# EAGLE design EIB A79024-001 (EAGLE 9.3.2)
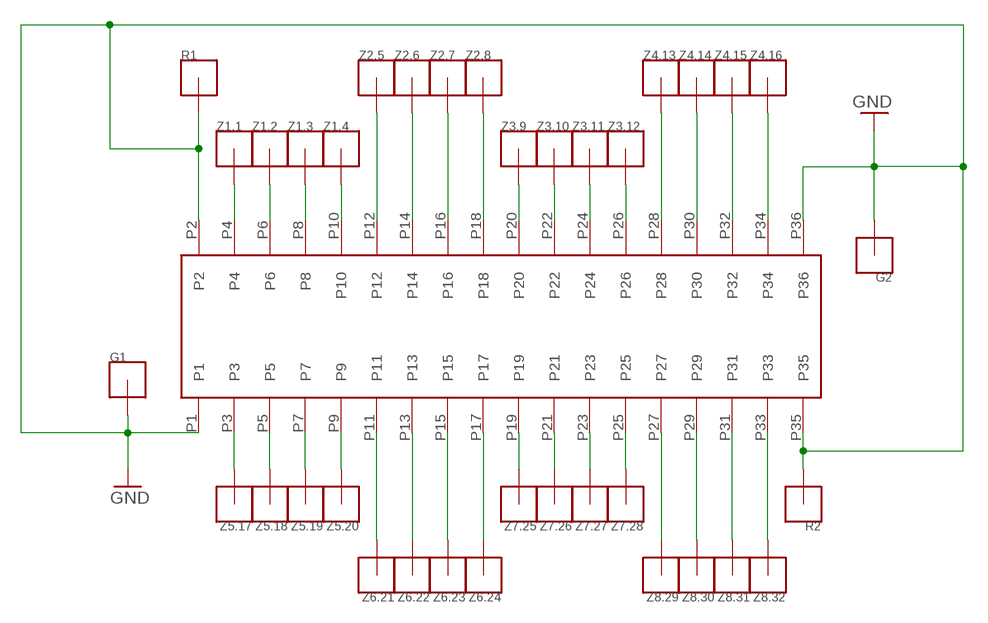
[diagram p0: schematic, sheet 1]

## Parts
A79024  OMNETICS  [A79024]
G1  S_P_HOLE  [S_P_HOLE]
G2  S_P_HOLE  [S_P_HOLE]
R1  S_P_HOLE  [S_P_HOLE]
R2  S_P_HOLE  [S_P_HOLE]
Z1.1  S_P_HOLE  [S_P_HOLE]
Z1.2  S_P_HOLE  [S_P_HOLE]
Z1.3  S_P_HOLE  [S_P_HOLE]
Z1.4  S_P_HOLE  [S_P_HOLE]
Z2.5  S_P_HOLE  [S_P_HOLE]
Z2.6  S_P_HOLE  [S_P_HOLE]
Z2.7  S_P_HOLE  [S_P_HOLE]
Z2.8  S_P_HOLE  [S_P_HOLE]
Z3.9  S_P_HOLE  [S_P_HOLE]
Z3.10  S_P_HOLE  [S_P_HOLE]
Z3.11  S_P_HOLE  [S_P_HOLE]
Z3.12  S_P_HOLE  [S_P_HOLE]
Z4.13  S_P_HOLE  [S_P_HOLE]
Z4.14  S_P_HOLE  [S_P_HOLE]
Z4.15  S_P_HOLE  [S_P_HOLE]
Z4.16  S_P_HOLE  [S_P_HOLE]
Z5.17  S_P_HOLE  [S_P_HOLE]
Z5.18  S_P_HOLE  [S_P_HOLE]
Z5.19  S_P_HOLE  [S_P_HOLE]
Z5.20  S_P_HOLE  [S_P_HOLE]
Z6.21  S_P_HOLE  [S_P_HOLE]
Z6.22  S_P_HOLE  [S_P_HOLE]
Z6.23  S_P_HOLE  [S_P_HOLE]
Z6.24  S_P_HOLE  [S_P_HOLE]
Z7.25  S_P_HOLE  [S_P_HOLE]
Z7.26  S_P_HOLE  [S_P_HOLE]
Z7.27  S_P_HOLE  [S_P_HOLE]
Z7.28  S_P_HOLE  [S_P_HOLE]
Z8.29  S_P_HOLE  [S_P_HOLE]
Z8.30  S_P_HOLE  [S_P_HOLE]
Z8.31  S_P_HOLE  [S_P_HOLE]
Z8.32  S_P_HOLE  [S_P_HOLE]

## Nets
GND: A79024.P1 A79024.P2 A79024.P35 A79024.P36 G1.P1 G2.P1 R1.P1 R2.P1
N$1: A79024.P4 Z1.1.P1
N$2: A79024.P6 Z1.2.P1
N$3: A79024.P8 Z1.3.P1
N$4: A79024.P10 Z1.4.P1
N$5: A79024.P12 Z2.5.P1
N$6: A79024.P14 Z2.6.P1
N$7: A79024.P16 Z2.7.P1
N$8: A79024.P18 Z2.8.P1
N$9: A79024.P20 Z3.9.P1
N$10: A79024.P22 Z3.10.P1
N$11: A79024.P24 Z3.11.P1
N$12: A79024.P26 Z3.12.P1
N$13: A79024.P28 Z4.13.P1
N$14: A79024.P30 Z4.14.P1
N$15: A79024.P32 Z4.15.P1
N$16: A79024.P34 Z4.16.P1
N$19: A79024.P33 Z8.32.P1
N$20: A79024.P31 Z8.31.P1
N$21: A79024.P29 Z8.30.P1
N$22: A79024.P27 Z8.29.P1
N$23: A79024.P25 Z7.28.P1
N$24: A79024.P23 Z7.27.P1
N$25: A79024.P21 Z7.26.P1
N$26: A79024.P19 Z7.25.P1
N$27: A79024.P17 Z6.24.P1
N$28: A79024.P15 Z6.23.P1
N$29: A79024.P13 Z6.22.P1
N$30: A79024.P11 Z6.21.P1
N$31: A79024.P9 Z5.20.P1
N$32: A79024.P7 Z5.19.P1
N$33: A79024.P5 Z5.18.P1
N$34: A79024.P3 Z5.17.P1

## Library data of the parts
A79024 = omnetics:OMNETICS
G1 G2 R1 R2 Z1.1-Z1.4 Z2.5-Z2.8 Z3.9-Z3.12 Z4.13-Z4.16 Z5.17-Z5.20 Z6.21-Z6.24 Z7.25-Z7.28 Z8.29-Z8.32 = omnetics:S_P_HOLE

## Board
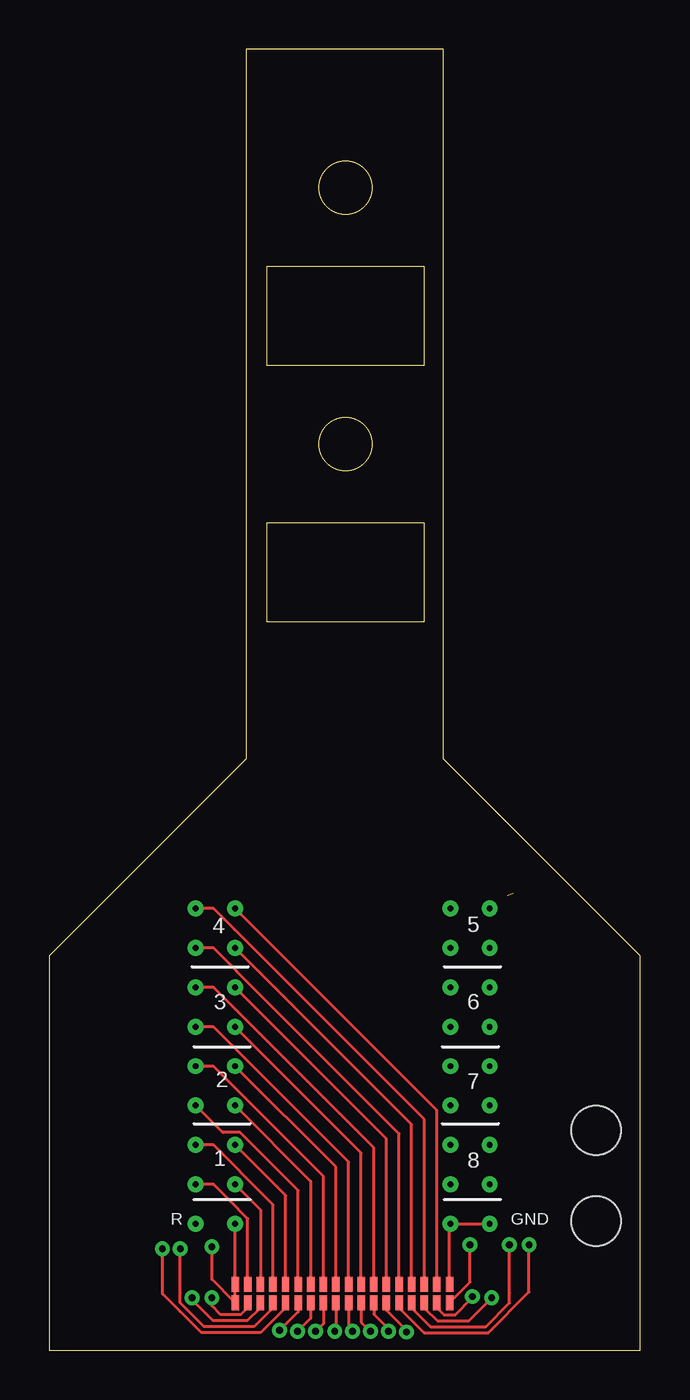
[diagram p1: board, top side]
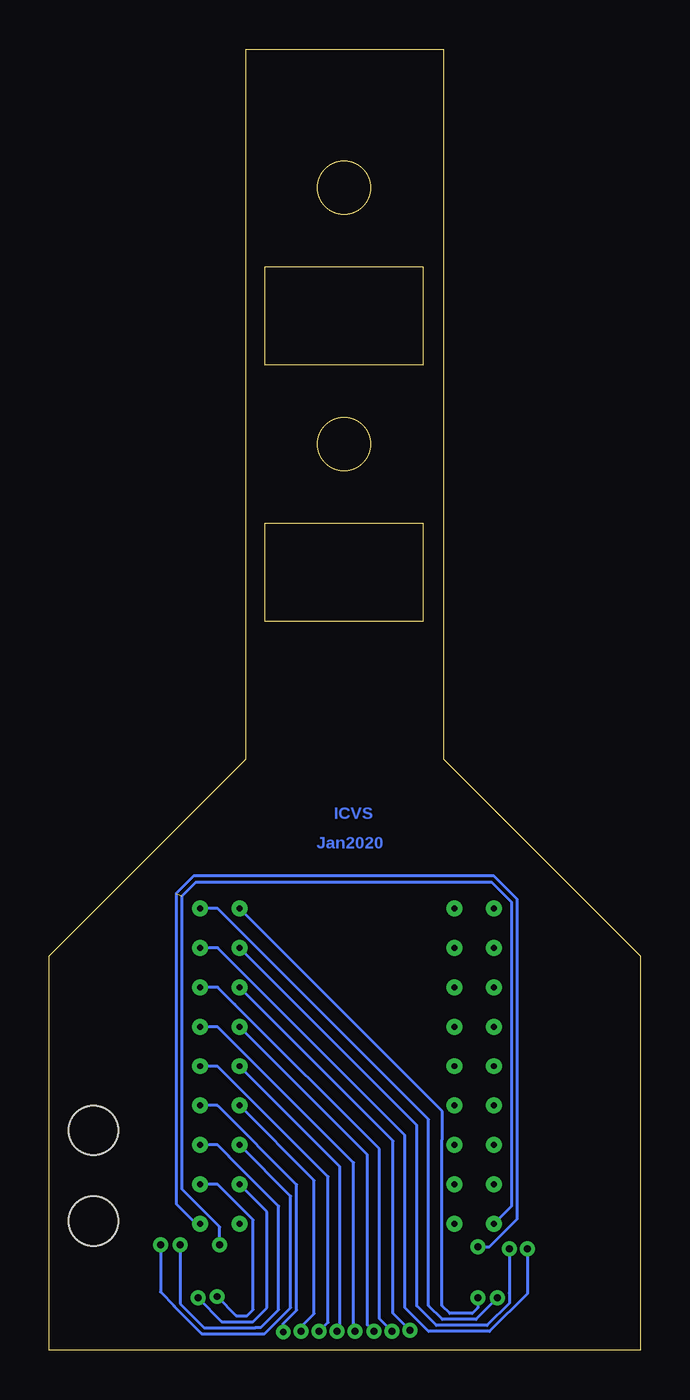
[diagram p2: board, bottom side, seen from below]

Size 30 x 66 mm. Coordinates in mm from the lower left corner, seen from the top.
Outline: 19.04,36.97 19.04,41.97 11.04,41.97 11.04,36.97 19.04,36.97
Outline: 19.04,49.97 19.04,54.97 11.04,54.97 11.04,49.97 19.04,49.97
Outline: 10,30 0,20 0,0 30,0 30,20 20,30 20,66 10,66 10,30
Outline: circle at 15.04,45.97 radius 1.35
Outline: circle at 15.04,58.97 radius 1.35
Copper layers (1*16): Top 0.035mm / dielectric 1.5mm / Bottom 0.035mm
Design rules "default": minimum track width 6mil, minimum drill 0.35mm, track to track 6mil, track to pad 6mil, pad to pad 6mil, via to via 6mil, smd to smd 6mil, copper to edge 40mil, drill to drill 6mil, minimum pad ring 10mil, minimum via ring 8mil, stop-mask expansion 4mil, vias tented up to drill 0mil, thermal gap 10mil
Holes 2.5 mm at 27.75,11.15 27.75,6.55

### Footprints (pad centres in the part's own frame; a part is rotated, then mirrored left to right if it is on the bottom)
A79024 = smd 0.38 x 0.76: P1 0,0; P2 0,0.94; P3 0.64,0; P4 0.64,0.94; P5 1.28,0; P6 1.28,0.94; P7 1.92,0; P8 1.92,0.94; P9 2.56,0; P10 2.56,0.94; P11 3.2,0; P12 3.2,0.94; P13 3.84,0; P14 3.84,0.94; P15 4.48,0; P16 4.48,0.94; P17 5.12,0; P18 5.12,0.94; P19 5.76,0; P20 5.76,0.94; P21 6.4,0; P22 6.4,0.94; P23 7.04,0; P24 7.04,0.94; P25 7.68,0; P26 7.68,0.94; P27 8.32,0; P28 8.32,0.94; P29 8.96,0; P30 8.96,0.94; P31 9.6,0; P32 9.6,0.94; P33 10.24,0; P34 10.24,0.94; P35 10.88,0; P36 10.88,0.94
S_P_HOLE = drill 0.3 pad 0.6: P1 0,0

### Placement (x,y rotation side)
A79024  9.43,2.41 0 top
G1  22.35,6.41 0 top
G2  20.35,6.41 0 top
R1  9.43,6.41 0 top
R2  7.43,6.41 0 top
Z1.1  7.43,8.41 0 top
Z1.2  9.43,8.41 0 top
Z1.3  7.43,10.41 0 top
Z1.4  9.43,10.41 0 top
Z2.5  7.43,12.41 0 top
Z2.6  9.43,12.41 0 top
Z2.7  7.43,14.41 0 top
Z2.8  9.43,14.41 0 top
Z3.9  7.43,16.41 0 top
Z3.10  9.43,16.41 0 top
Z3.11  7.43,18.41 0 top
Z3.12  9.43,18.41 0 top
Z4.13  7.43,20.41 0 top
Z4.14  9.43,20.41 0 top
Z4.15  7.43,22.41 0 top
Z4.16  9.43,22.41 0 top
Z5.17  20.35,22.41 0 top
Z5.18  22.35,22.41 0 top
Z5.19  20.35,20.41 0 top
Z5.20  22.35,20.41 0 top
Z6.21  20.35,18.41 0 top
Z6.22  22.35,18.41 0 top
Z6.23  20.35,16.41 0 top
Z6.24  22.35,16.41 0 top
Z7.25  20.35,14.41 0 top
Z7.26  22.35,14.41 0 top
Z7.27  20.35,12.41 0 top
Z7.28  22.35,12.41 0 top
Z8.29  20.35,10.41 0 top
Z8.30  22.35,10.41 0 top
Z8.31  20.35,8.41 0 top
Z8.32  22.35,8.41 0 top

### Tracks (layer width: path | path; a pad name or v marks a point on that pad's centre or on a via)
GND  (via drill 0.35)  (1 unrouted)
  Top 0.152: A79024.P36 20.31,6.37 G2.P1 G1.P1 | v8.25,5.25 8.25,3.59 A79024.P1 A79024.P2 R1.P1 | A79024.P35 21.35,3.45 v21.35,5.35
  Bottom 0.152: v8.25,5.25 7.65,5.25 6.25,6.66 6.25,22.88 7.43,24.06 22.68,24.06 23.56,23.18 23.56,7.43 22.54,6.41 G1.P1 | v21.35,5.35 21.35,6.25 23.25,8.15 23.25,23.05 22.55,23.75 7.55,23.75 6.55,22.75 6.55,7.29 R2.P1
N$1
  Top 0.152: Z1.1.P1 8.33,8.41 9.6,7.15 9.59,7.15 10.07,6.67 A79024.P4
N$2
  Top 0.152: Z1.2.P1 10.71,7.13 A79024.P6
N$3
  Top 0.152: Z1.3.P1 8.33,10.41 9.7,9.05 9.69,9.05 11.35,7.39 A79024.P8
N$4
  Top 0.152: A79024.P10 11.99,7.85 Z1.4.P1
N$5
  Top 0.152: Z2.5.P1 8.8,11.05 9.69,11.05 12.63,8.11 A79024.P12
N$6
  Top 0.152: Z2.6.P1 13.27,8.57 A79024.P14
N$7
  Top 0.152: Z2.7.P1 8.33,14.41 9.4,13.35 9.39,13.35 13.91,8.83 A79024.P16
N$8
  Top 0.152: A79024.P18 14.55,9.29 Z2.8.P1
N$9
  Top 0.152: Z3.9.P1 8.33,16.41 9.4,15.35 9.39,15.35 15.19,9.55 A79024.P20
N$10
  Top 0.152: A79024.P22 15.83,10.01 Z3.10.P1
N$11
  Top 0.152: Z3.11.P1 8.33,18.41 9.4,17.35 9.39,17.35 16.47,10.27 A79024.P24
N$12
  Top 0.152: A79024.P26 17.11,10.73 Z3.12.P1
N$13
  Top 0.152: Z4.13.P1 8.33,20.41 9.5,19.25 9.49,19.25 17.75,10.99 A79024.P28
N$14
  Top 0.152: A79024.P30 18.39,11.45 Z4.14.P1
N$15
  Top 0.152: Z4.15.P1 8.33,22.41 9.4,21.35 9.39,21.35 19.03,11.71 A79024.P32
N$16
  Top 0.152: A79024.P34 19.67,12.17 Z4.16.P1
N$19  (via drill 0.35)
  Top 0.152: A79024.P33 19.67,2.11 19.69,2.09 19.69,2.14 20.03,1.8 20.6,1.8 21.48,2.68 v21.48,2.72
  Bottom 0.152: v21.48,2.72 20.51,1.75 19.95,1.75 19.65,2.05 19.65,6.61 20.49,7.45 20.48,7.45 21.45,8.41 Z8.32.P1
N$20  (via drill 0.35)
  Top 0.152: A79024.P31 19.05,2.39 19.05,2.14 19.69,1.5 21.3,1.5 v22.45,2.65
  Bottom 0.152: v22.45,2.65 21.25,1.45 19.66,1.45 18.95,2.15 18.95,7.01 Z8.31.P1
N$21  (via drill 0.35)
  Top 0.152: A79024.P29 18.41,2.39 18.41,2.14 19.36,1.2 22.15,1.2 23.36,2.4 23.36,2.9 23.35,2.91 v23.35,5.35
  Bottom 0.152: v23.35,5.35 23.35,2.91 23.36,2.9 23.36,2.36 22.14,1.14 19.53,1.14 19.52,1.15 19.25,1.15 18.35,2.05 18.35,7.31 20.89,9.85 20.88,9.85 21.45,10.41 Z8.30.P1
N$22  (via drill 0.35)
  Top 0.152: v24.35,5.35 24.35,2.96 22.28,0.89 19.02,0.89 17.77,2.14 17.77,2.39 A79024.P27
  Bottom 0.152: v24.35,5.35 24.35,2.95 23.66,2.27 23.66,2.23 22.27,0.84 19.07,0.84 17.75,2.15 17.75,7.81 Z8.29.P1
N$23  (via drill 0.35)
  Top 0.152: A79024.P25 17.11,2.04 18.12,1.02 v18.12,0.92
  Bottom 0.152: v18.12,0.92 18.12,1.35 17.45,2.03 17.45,8.4 21.46,12.41 Z7.28.P1
N$24  (via drill 0.35)
  Top 0.152: A79024.P23 16.47,1.83 17.21,1.09 v17.21,0.95
  Bottom 0.152: v17.21,0.95 17.21,1.19 16.55,1.85 16.55,8.61 Z7.27.P1
N$25  (via drill 0.35)
  Top 0.152: A79024.P21 15.83,1.43 v16.3,0.95
  Bottom 0.152: v16.3,0.95 15.85,1.41 15.85,8.81 21.46,14.41 Z7.26.P1
N$26  (via drill 0.35)
  Top 0.152: A79024.P19 15.19,1.16 v15.4,0.95
  Bottom 0.152: v15.4,0.95 15.25,1.1 15.25,9.31 Z7.25.P1
N$27  (via drill 0.35)
  Top 0.152: v14.49,0.95 14.55,1.02 A79024.P17
  Bottom 0.152: v14.49,0.95 14.55,1.02 14.55,9.51 21.46,16.41 Z6.24.P1
N$28  (via drill 0.35)
  Top 0.152: A79024.P15 13.91,1.35 v13.51,0.95
  Bottom 0.152: v13.51,0.95 13.85,1.29 13.85,9.91 Z6.23.P1
N$29  (via drill 0.35)
  Top 0.152: A79024.P13 13.27,1.62 v12.61,0.95
  Bottom 0.152: v12.61,0.95 13.25,1.6 13.25,10.21 20.59,17.55 20.58,17.55 21.45,18.41 Z6.22.P1
N$30  (via drill 0.35)
  Top 0.152: A79024.P11 12.63,1.94 v11.7,1.01
  Bottom 0.152: v11.7,1.01 12.55,1.86 12.55,10.61 Z6.21.P1
N$31  (via drill 0.35)
  Top 0.152: A79024.P9 11.97,2.39 11.97,2.14 10.72,0.89 7.73,0.89 6.64,1.98 6.64,1.97 5.74,2.86 v5.74,5.15
  Bottom 0.152: v5.74,5.15 5.74,2.86 7.65,0.95 10.75,0.95 11.95,2.15 11.95,10.91 20.49,19.45 20.48,19.45 21.45,20.41 Z5.20.P1
N$32  (via drill 0.35)
  Top 0.152: A79024.P7 11.33,2.39 11.33,2.14 10.39,1.2 7.85,1.2 6.64,2.4 6.64,2.9 6.65,2.91 v6.65,5.15
  Bottom 0.152: v6.65,5.15 6.65,2.91 6.64,2.9 6.64,2.39 7.78,1.26 10.36,1.26 11.35,2.25 11.35,11.41 Z5.19.P1
N$33  (via drill 0.35)
  Top 0.152: A79024.P5 10.71,2.11 10.69,2.09 10.69,2.14 10.05,1.5 8.3,1.5 7.25,2.55 v7.25,2.65
  Bottom 0.152: v7.25,2.65 8.34,1.56 10.05,1.56 10.75,2.26 10.75,11.71 20.59,21.55 20.58,21.55 21.45,22.41 Z5.18.P1
N$34  (via drill 0.35)
  Top 0.152: A79024.P3 10.05,2.39 10.05,2.14 9.72,1.8 8.7,1.8 8.25,2.25 v8.25,2.65
  Bottom 0.152: v8.25,2.65 8.25,2.15 8.54,1.87 9.67,1.87 10.06,2.27 10.06,10.68 10.05,10.69 10.05,12.11 Z5.17.P1

### Text on the board
Bottom: ICVS | Jan2020
tNames: 4 | 5 | 3 | 6 | 2 | 7 | 1 | 8 | R | GND